# Altium schematic sheet SunS_Connectors.SchDoc: Connectors
size A3; Author: Michał Gumiela; ProjectName: SunS
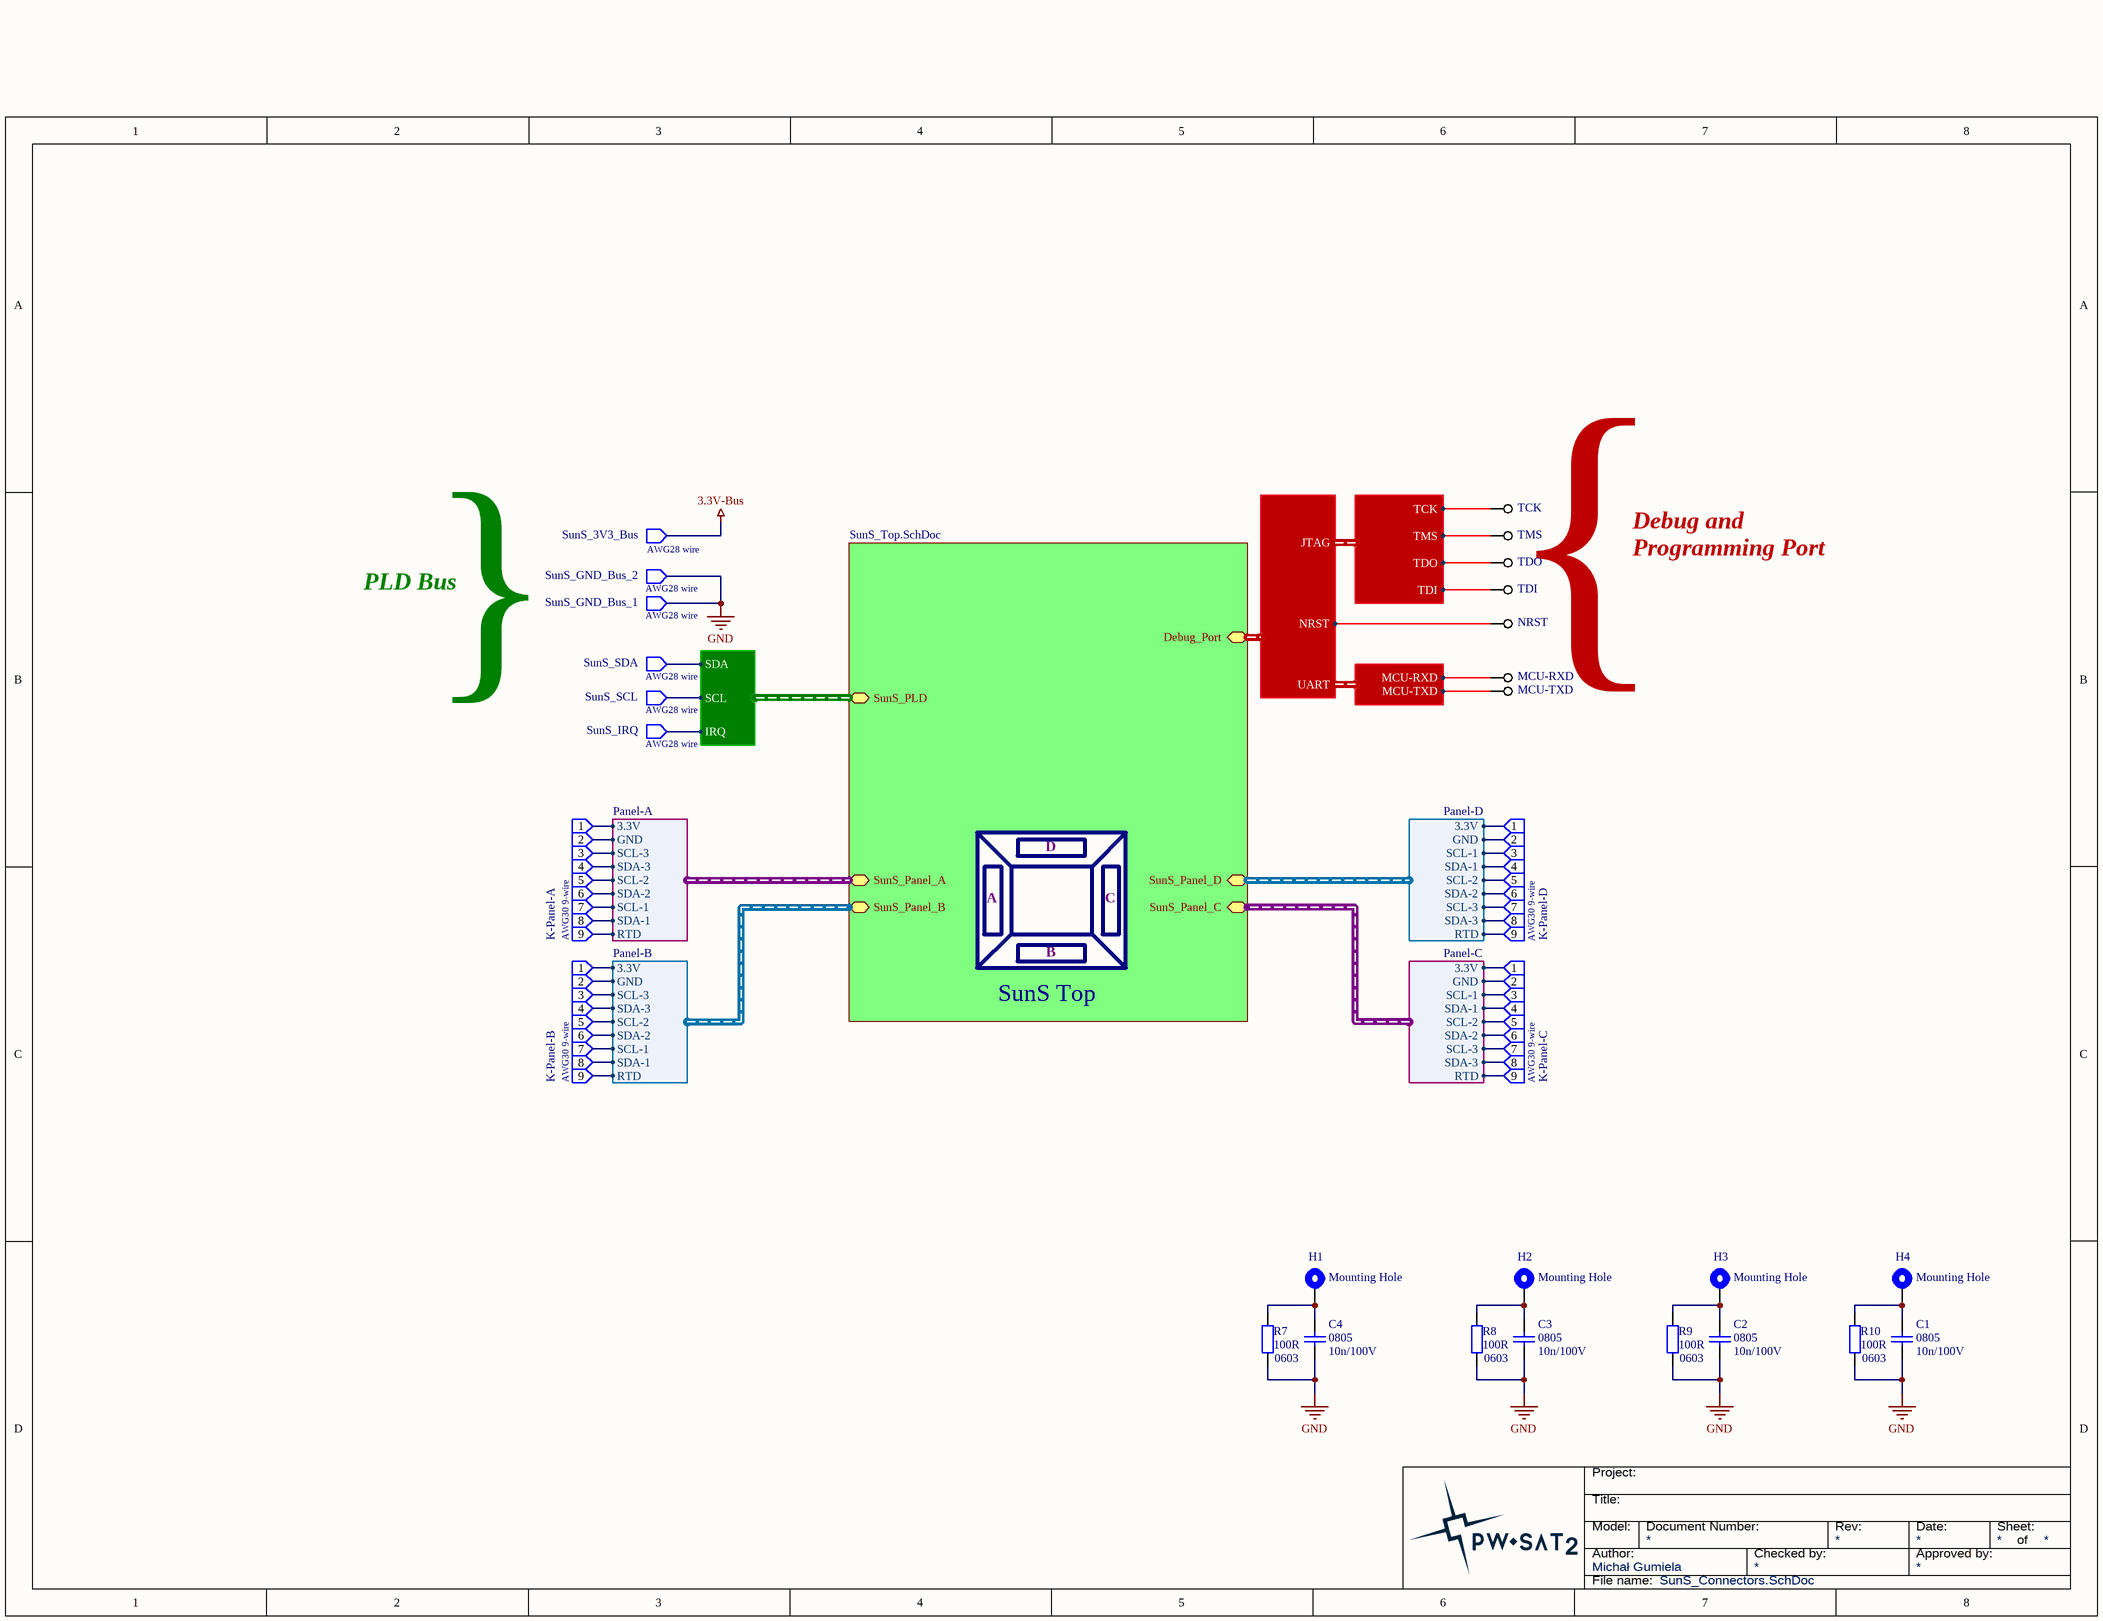
[diagram p0: SunS_Connectors.SchDoc]

## Parts
C1  Package: 0805  [SMD_Capacitor_0805]  (hidden comment: 10n/100V)
C2  Package: 0805  [SMD_Capacitor_0805]  (hidden comment: 10n/100V)
C3  Package: 0805  [SMD_Capacitor_0805]  (hidden comment: 10n/100V)
C4  Package: 0805  [SMD_Capacitor_0805]  (hidden comment: 10n/100V)
H1  Mounting Hole  [SunS_PcbMntHole_M2]
H2  Mounting Hole  [SunS_PcbMntHole_M2]
H3  Mounting Hole  [SunS_PcbMntHole_M2]
H4  Mounting Hole  [SunS_PcbMntHole_M2]
K-Panel-A  AWG30 9-wire  [Wire_AWG-30_9_stress-relief]
K-Panel-B  AWG30 9-wire  [Wire_AWG-30_9_stress-relief]
K-Panel-C  AWG30 9-wire  [Wire_AWG-30_9_stress-relief]
K-Panel-D  AWG30 9-wire  [Wire_AWG-30_9_stress-relief]
MCU-RXD  Testpoint  [Testpoint pad]  (value not drawn)
MCU-TXD  Testpoint  [Testpoint pad]  (value not drawn)
NRST  Testpoint  [Testpoint pad]  (value not drawn)
R7  Package: 0603  [SMD_Resistor_0603]  (hidden comment: 100R)
R8  Package: 0603  [SMD_Resistor_0603]  (hidden comment: 100R)
R9  Package: 0603  [SMD_Resistor_0603]  (hidden comment: 100R)
R10  Package: 0603  [SMD_Resistor_0603]  (hidden comment: 100R)
SunS_3V3_Bus  AWG28 wire  [Wire_AWG-28_stress-relief]
SunS_GND_Bus_1  AWG28 wire  [Wire_AWG-28_stress-relief]
SunS_GND_Bus_2  AWG28 wire  [Wire_AWG-28_stress-relief]
SunS_IRQ  AWG28 wire  [Wire_AWG-28_stress-relief]
SunS_SCL  AWG28 wire  [Wire_AWG-28_stress-relief]
SunS_SDA  AWG28 wire  [Wire_AWG-28_stress-relief]
TCK  Testpoint  [Testpoint pad]  (value not drawn)
TDI  Testpoint  [Testpoint pad]  (value not drawn)
TDO  Testpoint  [Testpoint pad]  (value not drawn)
TMS  Testpoint  [Testpoint pad]  (value not drawn)

## Sub-sheets
SunS Top = SunS_Top.SchDoc: Debug_Port (harness SunS-Debug-Port), SunS_PLD (harness SunS_PLD_Bus), SunS_Panel_A (harness Panel-A), SunS_Panel_B (harness Panel-B), SunS_Panel_D (harness Panel-D), SunS_Panel_C (harness Panel-C)

## Harnesses
SunS_PLD_Bus: SCL, SDA, IRQ
SunS-UART: MCU-RXD, MCU-TXD
Panel-A: 3.3V, GND, SDA-1, SCL-1, SDA-2, SCL-2, SDA-3, SCL-3, RTD
Panel-B: 3.3V, GND, SDA-1, SCL-1, SDA-2, SCL-2, SDA-3, SCL-3, RTD
Panel-D: 3.3V, GND, SDA-1, SCL-1, SDA-2, SCL-2, SDA-3, SCL-3, RTD
Panel-C: 3.3V, GND, SDA-1, SCL-1, SDA-2, SCL-2, SDA-3, SCL-3, RTD
SunS-Debug-Port: NRST, UART, JTAG
JTAG: TDO, TDI, TMS, TCK

## Nets
3.3V-Bus: SunS_3V3_Bus.1
GND: C1.2 C2.2 C3.2 C4.2 R7.2 R8.2 R9.2 R10.2 SunS_GND_Bus_1.1 SunS_GND_Bus_2.1
NetC1_1: C1.1 H4.1 R10.1
NetC2_1: C2.1 H3.1 R9.1
NetC3_1: C3.1 H2.1 R8.1
NetC4_1: C4.1 H1.1 R7.1
NetK-Panel-A_1: K-Panel-A.1 ; sheet SunS Top/SunS_Panel_A.3.3V
NetK-Panel-A_2: K-Panel-A.2 ; sheet SunS Top/SunS_Panel_A.GND
NetK-Panel-A_3: K-Panel-A.3 ; sheet SunS Top/SunS_Panel_A.SCL-3
NetK-Panel-A_4: K-Panel-A.4 ; sheet SunS Top/SunS_Panel_A.SDA-3
NetK-Panel-A_5: K-Panel-A.5 ; sheet SunS Top/SunS_Panel_A.SCL-2
NetK-Panel-A_6: K-Panel-A.6 ; sheet SunS Top/SunS_Panel_A.SDA-2
NetK-Panel-A_7: K-Panel-A.7 ; sheet SunS Top/SunS_Panel_A.SCL-1
NetK-Panel-A_8: K-Panel-A.8 ; sheet SunS Top/SunS_Panel_A.SDA-1
NetK-Panel-A_9: K-Panel-A.9 ; sheet SunS Top/SunS_Panel_A.RTD
NetK-Panel-B_1: K-Panel-B.1 ; sheet SunS Top/SunS_Panel_B.3.3V
NetK-Panel-B_2: K-Panel-B.2 ; sheet SunS Top/SunS_Panel_B.GND
NetK-Panel-B_3: K-Panel-B.3 ; sheet SunS Top/SunS_Panel_B.SCL-3
NetK-Panel-B_4: K-Panel-B.4 ; sheet SunS Top/SunS_Panel_B.SDA-3
NetK-Panel-B_5: K-Panel-B.5 ; sheet SunS Top/SunS_Panel_B.SCL-2
NetK-Panel-B_6: K-Panel-B.6 ; sheet SunS Top/SunS_Panel_B.SDA-2
NetK-Panel-B_7: K-Panel-B.7 ; sheet SunS Top/SunS_Panel_B.SCL-1
NetK-Panel-B_8: K-Panel-B.8 ; sheet SunS Top/SunS_Panel_B.SDA-1
NetK-Panel-B_9: K-Panel-B.9 ; sheet SunS Top/SunS_Panel_B.RTD
NetK-Panel-C_1: K-Panel-C.1 ; sheet SunS Top/SunS_Panel_C.3.3V
NetK-Panel-C_2: K-Panel-C.2 ; sheet SunS Top/SunS_Panel_C.GND
NetK-Panel-C_3: K-Panel-C.3 ; sheet SunS Top/SunS_Panel_C.SCL-1
NetK-Panel-C_4: K-Panel-C.4 ; sheet SunS Top/SunS_Panel_C.SDA-1
NetK-Panel-C_5: K-Panel-C.5 ; sheet SunS Top/SunS_Panel_C.SCL-2
NetK-Panel-C_6: K-Panel-C.6 ; sheet SunS Top/SunS_Panel_C.SDA-2
NetK-Panel-C_7: K-Panel-C.7 ; sheet SunS Top/SunS_Panel_C.SCL-3
NetK-Panel-C_8: K-Panel-C.8 ; sheet SunS Top/SunS_Panel_C.SDA-3
NetK-Panel-C_9: K-Panel-C.9 ; sheet SunS Top/SunS_Panel_C.RTD
NetK-Panel-D_1: K-Panel-D.1 ; sheet SunS Top/SunS_Panel_D.3.3V
NetK-Panel-D_2: K-Panel-D.2 ; sheet SunS Top/SunS_Panel_D.GND
NetK-Panel-D_3: K-Panel-D.3 ; sheet SunS Top/SunS_Panel_D.SCL-1
NetK-Panel-D_4: K-Panel-D.4 ; sheet SunS Top/SunS_Panel_D.SDA-1
NetK-Panel-D_5: K-Panel-D.5 ; sheet SunS Top/SunS_Panel_D.SCL-2
NetK-Panel-D_6: K-Panel-D.6 ; sheet SunS Top/SunS_Panel_D.SDA-2
NetK-Panel-D_7: K-Panel-D.7 ; sheet SunS Top/SunS_Panel_D.SCL-3
NetK-Panel-D_8: K-Panel-D.8 ; sheet SunS Top/SunS_Panel_D.SDA-3
NetK-Panel-D_9: K-Panel-D.9 ; sheet SunS Top/SunS_Panel_D.RTD
NetMCU-RXD_1: MCU-RXD.1(TP) ; harness SunS-UART.MCU-RXD
NetMCU-TXD_1: MCU-TXD.1(TP) ; harness SunS-UART.MCU-TXD
NetNRST_1: NRST.1(TP) ; sheet SunS Top/Debug_Port.NRST
NetSunS_IRQ_1: SunS_IRQ.1 ; sheet SunS Top/SunS_PLD.IRQ
NetSunS_SCL_1: SunS_SCL.1 ; sheet SunS Top/SunS_PLD.SCL
NetSunS_SDA_1: SunS_SDA.1 ; sheet SunS Top/SunS_PLD.SDA
NetTCK_1: TCK.1(TP) ; harness JTAG.TCK
NetTDI_1: TDI.1(TP) ; harness JTAG.TDI
NetTDO_1: TDO.1(TP) ; harness JTAG.TDO
NetTMS_1: TMS.1(TP) ; harness JTAG.TMS

## Notes on the sheet
- }
- {
- Debug and
- Programming Port
- PLD Bus
- D
- A
- B
- C
- Title:
- Project:
- Author:
- Model:
- Document Number:
- Checked by:
- Rev:
- Date:
- Approved by:
- Sheet:
- of
- File name:

## Library data of the parts
C1-C4 = Cer_C0805T104K1RCLTU: Ceramic Cap Kemet COTS 100n/100V X7R 0805; ManufacturerPartNumber: C0805T104K1RCLTU; Manufacturer: Kemet; Value: 10n/100V
H1-H4 = MntHole: PCB Mounting Hole; Value: Mounting Hole
K-Panel-A K-Panel-B K-Panel-C K-Panel-D = wire-awg30-9: 9 x wire AWG30 solder point.; Value: AWG30 9-wire
R7-R10 = Res: Value: 100R
SunS_3V3_Bus SunS_GND_Bus_1 SunS_GND_Bus_2 SunS_IRQ SunS_SCL SunS_SDA = wire-awg30-1: Single wire AWG28 solder point.; Value: AWG28 wire